# EAGLE design 7seg (EAGLE 7.2.0)
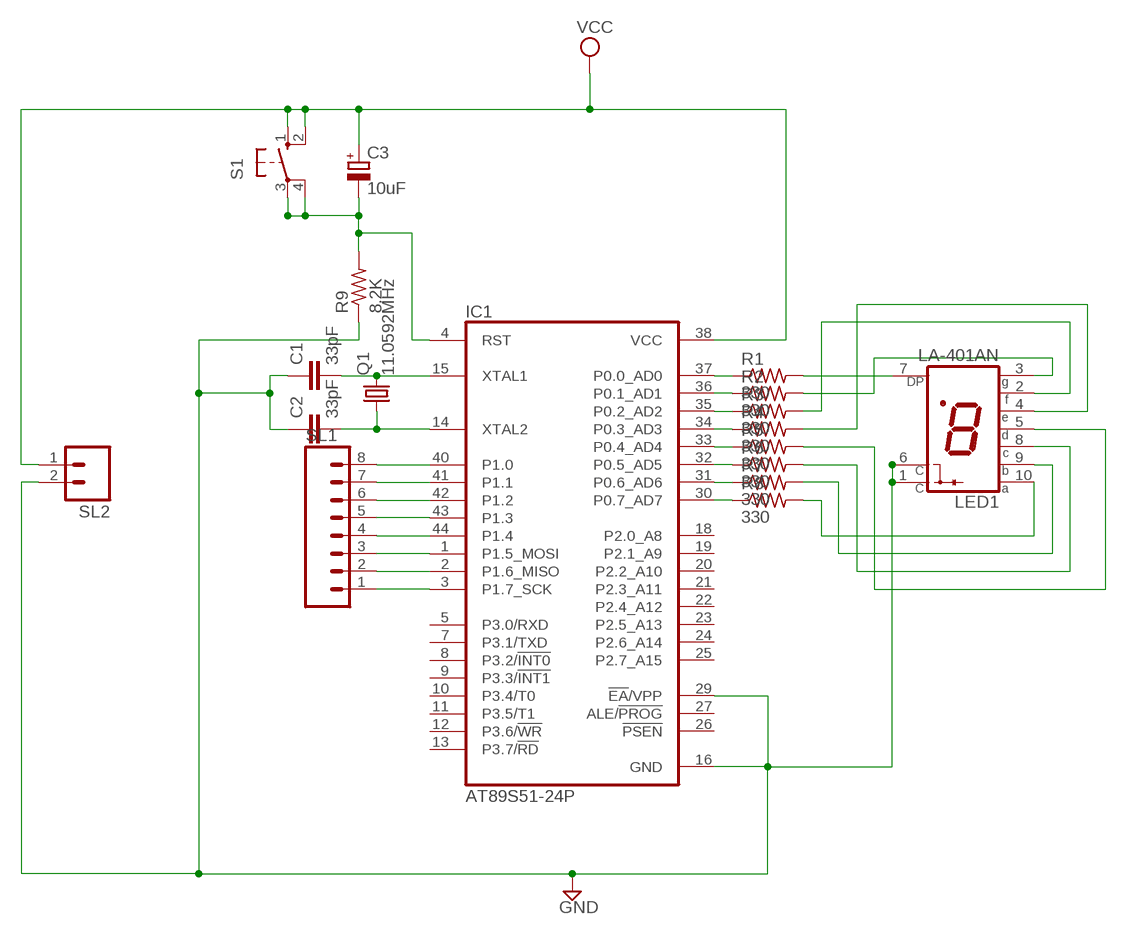
[diagram p0: schematic, sheet 1]

## Parts
C1  33pF  C-EUC1206K  [C1206K]
C2  33pF  C-EUC1206K  [C1206K]
C3  10uF  CPOL-EU140CLH-1010  [140CLH-1010]
IC1  AT89S51-24P  [TQFP44]
LED1  LA-401AN  [LA-401]
Q1  11.0592MHz  CRYSTALTC26V  [TC26V]
R1  330  R-US_M1206  [M1206]
R2  330  R-US_M1206  [M1206]
R3  330  R-US_M1206  [M1206]
R4  330  R-US_M1206  [M1206]
R5  330  R-US_M1206  [M1206]
R6  330  R-US_M1206  [M1206]
R7  330  R-US_M1206  [M1206]
R8  330  R-US_M1206  [M1206]
R9  8.2K  R-US_M1206  [M1206]
S1  10-XX  [B3F-10XX]
SL1  MA08  [08PA]
SL2  MA02  [02PA]

## Nets
GND: C1.1 C2.1 IC1.16(GND) IC1.29(!EA!/VPP) LED1.1(C) LED1.6(C) R9.1 SL2.2
N$1: IC1.37(P0.0_AD0) R1.1
N$2: IC1.36(P0.1_AD1) R2.1
N$3: IC1.35(P0.2_AD2) R3.1
N$4: IC1.34(P0.3_AD3) R4.1
N$5: IC1.33(P0.4_AD4) R5.1
N$6: IC1.32(P0.5_AD5) R6.1
N$7: IC1.31(P0.6_AD6) R7.1
N$8: IC1.30(P0.7_AD7) R8.1
N$9: LED1.7(DP) R1.2
N$10: LED1.3(G) R2.2
N$11: LED1.2(F) R3.2
N$13: LED1.10(A) R8.2
N$14: LED1.9(B) R7.2
N$15: LED1.8(C) R6.2
N$16: LED1.5(D) R5.2
N$17: LED1.4(E) R4.2
N$18: IC1.40(P1.0) SL1.8
N$19: IC1.41(P1.1) SL1.7
N$20: IC1.42(P1.2) SL1.6
N$21: IC1.43(P1.3) SL1.5
N$22: IC1.44(P1.4) SL1.4
N$23: IC1.1(P1.5_MOSI) SL1.3
N$24: IC1.2(P1.6_MISO) SL1.2
N$25: IC1.3(P1.7_SCK) SL1.1
N$26: C1.2 IC1.15(XTAL1) Q1.2
N$27: C2.2 IC1.14(XTAL2) Q1.1
N$30: C3.- IC1.4(RST) R9.2 S1.3(P) S1.4(P1)
VCC: C3.+ IC1.38(VCC) S1.1(S) S1.2(S1) SL2.1
Unconnected: IC1.5(P3.0/RXD) IC1.7(P3.1/TXD) IC1.8(P3.2/!INT0) IC1.9(P3.3/!INT1) IC1.10(P3.4/T0) IC1.11(P3.5/T1) IC1.12(P3.6/!WR) IC1.13(P3.7/!RD) IC1.18(P2.0_A8) IC1.19(P2.1_A9) IC1.20(P2.2_A10) IC1.21(P2.3_A11) IC1.22(P2.4_A12) IC1.23(P2.5_A13) IC1.24(P2.6_A14) IC1.25(P2.7_A15) IC1.26(!PSEN) IC1.27(ALE/!PROG)

## Power pins joined to a net without a drawn wire
GND: IC1.17(GND)

## Library data of the parts
C1 C2 = resistor:C-EU: CAPACITOR, European symbol
C3 = resistor:CPOL-EU: POLARIZED CAPACITOR, European symbol
IC1 = atmel:AT89S51*P: 8-bit Microcontroller with 4K BytesIn-System Programmable Flash Source: http://www.atmel.com/dyn/resources/prod_documents/doc2487.pdf; OC_FARNELL: unknown; OC_NEWARK: unknown
LED1 = led-7-segment:LA-401*N: Single Digit LED Numeric Display (cathode common) Source: ROHM .. la-1401dn.pdf; OC_FARNELL: unknown; OC_NEWARK: unknown
Q1 = crystal:CRYSTAL: CRYSTAL; OC_FARNELL: unknown; OC_NEWARK: unknown
R1-R9 = resistor:R-US_: RESISTOR, American symbol
S1 = switch-omron:10-XX: OMRON SWITCH; MPN: B3F-1000; OC_FARNELL: 176432; OC_NEWARK: 36M3542
SL1 = con-amp-quick:MA08: AMP QUICK CONNECTOR; OC_FARNELL: unknown; OC_NEWARK: unknown
SL2 = con-amp-quick:MA02: AMP QUICK CONNECTOR; OC_FARNELL: unknown; OC_NEWARK: unknown

## Board
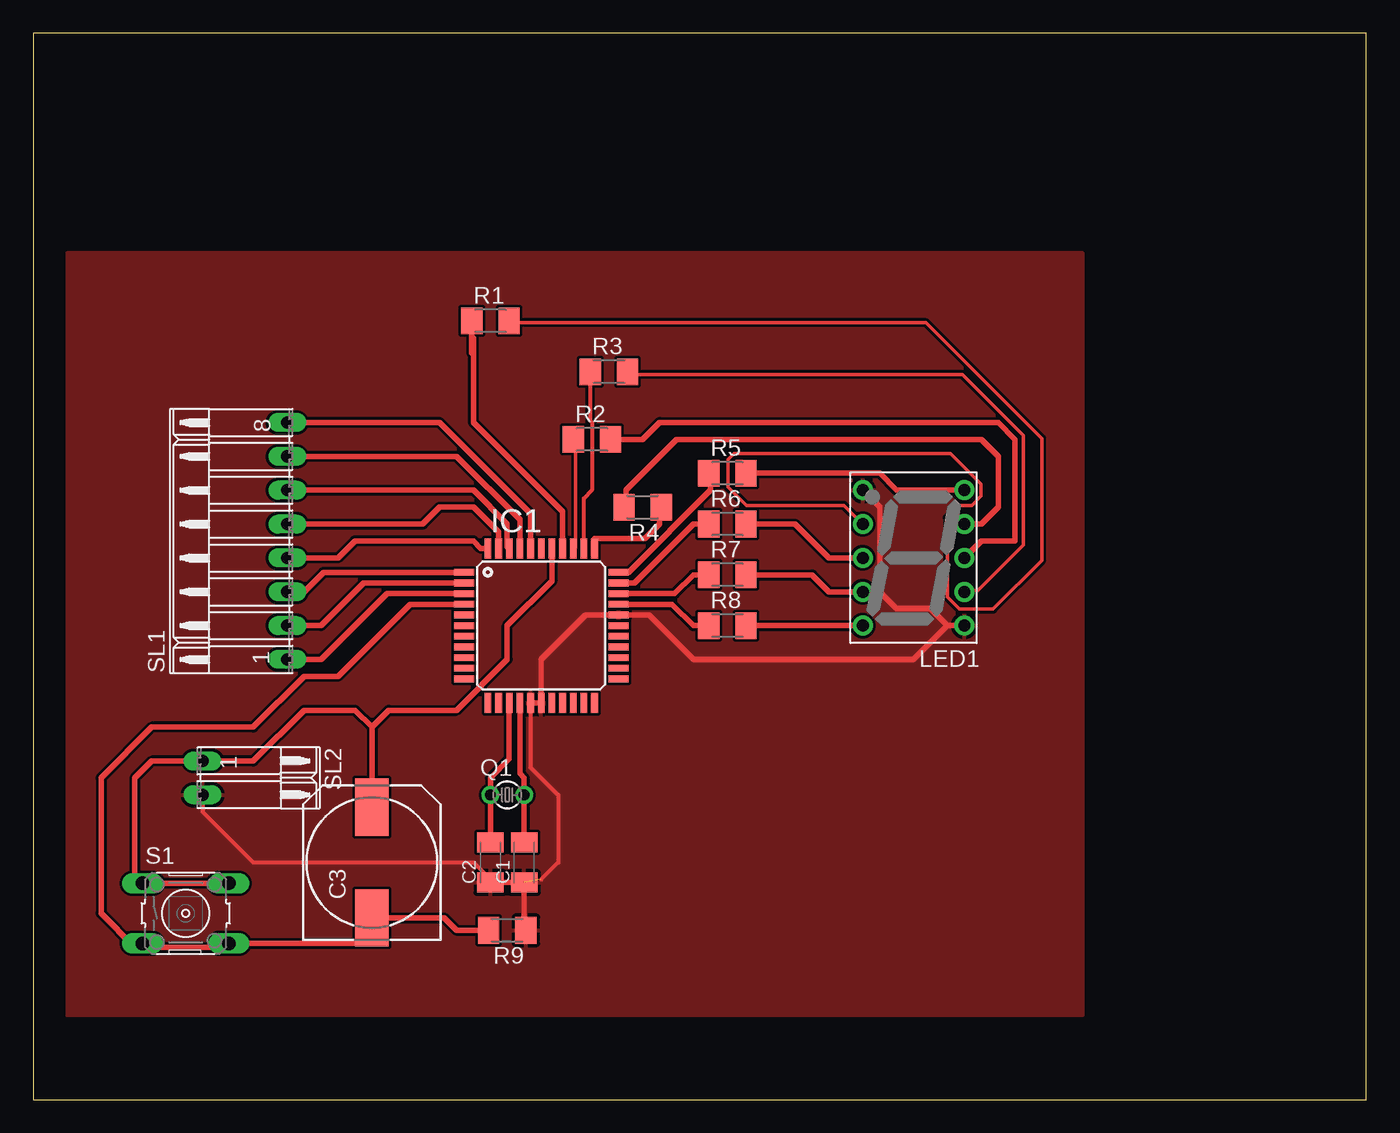
[diagram p1: board, top side]

Size 100 x 80 mm. Coordinates in mm from the lower left corner, seen from the top.
Outline: 0,0 100,0 100,80 0,80 0,0
Copper layers (1*16): Top 0.035mm / dielectric 1.5mm / Bottom 0.035mm
Design rules "default": minimum track width 10mil, minimum drill 24mil, track to track 8mil, track to pad 8mil, pad to pad 8mil, via to via 8mil, smd to smd 8mil, copper to edge 40mil, drill to drill 8mil, minimum pad ring 10mil, minimum via ring 8mil, stop-mask expansion 4mil, vias tented up to drill 0mil, thermal gap 10mil

### Footprints (pad centres in the part's own frame; a part is rotated, then mirrored left to right if it is on the bottom)
C1206K = smd 1.5 x 2: 1 -1.5,0; 2 1.5,0
140CLH-1010 = smd 4.3 x 2.5: + 4.15,0; - -4.15,0
TQFP44 = smd 1.5 x 0.5: 1 -5.8,4; 2 -5.8,3.2; 3 -5.8,2.4; 4 -5.8,1.6; 5 -5.8,0.8; 6 -5.8,0; 7 -5.8,-0.8; 8 -5.8,-1.6; 9 -5.8,-2.4; 10 -5.8,-3.2; 11 -5.8,-4; 23 5.8,-4; 24 5.8,-3.2; 25 5.8,-2.4; 26 5.8,-1.6; 27 5.8,-0.8; 28 5.8,0; 29 5.8,0.8; 30 5.8,1.6; 31 5.8,2.4; 32 5.8,3.2; 33 5.8,4 | smd 0.5 x 1.5: 12 -4,-5.8; 13 -3.2,-5.8; 14 -2.4,-5.8; 15 -1.6,-5.8; 16 -0.8,-5.8; 17 0,-5.8; 18 0.8,-5.8; 19 1.6,-5.8; 20 2.4,-5.8; 21 3.2,-5.8; 22 4,-5.8; 34 4,5.8; 35 3.2,5.8; 36 2.4,5.8; 37 1.6,5.8; 38 0.8,5.8; 39 0,5.8; 40 -0.8,5.8; 41 -1.6,5.8; 42 -2.4,5.8; 43 -3.2,5.8; 44 -4,5.8
LA-401 = drill 0.9 pad 1.5: 1 -3.81,5.08; 2 -3.81,2.54; 3 -3.81,0; 4 -3.81,-2.54; 5 -3.81,-5.08; 6 3.81,-5.08; 7 3.81,-2.54; 8 3.81,0; 9 3.81,2.54; 10 3.81,5.08
TC26V = drill 0.813: 1 -1.27,0; 2 1.27,0
M1206 = smd 1.6 x 2: 1 -1.4,0; 2 1.4,0
B3F-10XX = drill 1.016 long: 1 -3.251,2.261; 2 3.251,2.261; 3 -3.251,-2.261; 4 3.251,-2.261
08PA = drill 0.914 long: 1 -8.89,0; 2 -6.35,0; 3 -3.81,0; 4 -1.27,0; 5 1.27,0; 6 3.81,0; 7 6.35,0; 8 8.89,0
02PA = drill 0.914 long: 1 -1.27,0; 2 1.27,0

### Placement (x,y rotation side)
C1  36.83,17.78 90 top
C2  34.29,17.78 90 top
C3  25.4,17.78 90 top
IC1  38.1,35.56 0 top
LED1  66.04,40.64 180 top
Q1  35.56,22.86 0 top
R1  34.29,58.42 0 top
R2  41.91,49.53 0 top
R3  43.18,54.61 0 top
R4  45.72,44.45 180 top
R5  52.07,46.99 0 top
R6  52.07,43.18 0 top
R7  52.07,39.37 0 top
R8  52.07,35.56 0 top
R9  35.56,12.7 180 top
S1  11.43,13.97 0 top
SL1  19.05,41.91 90 top
SL2  12.7,24.13 270 top

### Tracks (layer width: path | path; a pad name or v marks a point on that pad's centre or on a via)
GND  (1 unrouted)
  Top 0.254: IC1.17 38.18,29.95 38.18,30.4 38.1,30.48
  Top 0.305: SL2.2 12.7,21.59 16.51,17.78 33.02,17.78 34.29,16.51 C2.1 | C1.1 36.83,16.51 | IC1.16 37.3,24.93 39.37,22.86 39.37,17.78 38.1,16.51
  Top 0.406: C2.1 C1.1 36.83,12.83 R9.1 | IC1.16 IC1.17 | 38.1,30.48 38.1,33.02 41.44,36.36 IC1.29 46.19,36.36 49.53,33.02 66.04,33.02 68.58,35.56 | 68.58,35.56 LED1.1 | 68.58,35.56 67.31,36.83 64.77,36.83 63.5,38.1 63.5,44.45 LED1.6
  pour Top: 2.54,63.5 2.54,6.35 78.74,6.35 78.74,63.5
N$1
  Top 0.406: IC1.37 39.7,44.12 33.02,50.8 33.02,55.88 | 33.02,55.88 33.02,57.15 | R1.1 32.89,56.01 33.02,55.88
N$2
  Top 0.254: IC1.36 40.69,41.38 40.69,49.38 R2.1
N$3
  Top 0.305: R3.1 41.78,50.93 41.91,50.8 41.91,45.72 41.3,45.11 IC1.35
N$4
  Top 0.406: IC1.34 42.1,42.1 45.91,42.1 46.99,43.18 46.99,44.32 R4.1
N$5
  Top 0.406: IC1.33 44.64,39.56 50.8,45.72 50.8,46.86 R5.1
N$6
  Top 0.406: IC1.32 45.11,38.76 49.53,43.18 R6.1
N$7
  Top 0.406: R7.1 49.53,39.37 48.12,37.96 IC1.31
N$8
  Top 0.406: IC1.30 47.93,37.16 49.53,35.56 R8.1
N$9
  Top 0.254: R1.2 35.89,58.29 66.98,58.29 75.67,49.61 75.67,40.46 72.01,36.8 69.49,36.8 68.58,37.72 68.58,43.66 69.49,44.58 70.41,44.58 71.09,45.26 71.09,46.18 68.81,48.46 52.58,48.46 52.12,48.01 52.12,45.95 53.49,44.58 60.81,44.58 62.18,43.2 LED1.7
N$10
  Top 0.406: R2.2 45.72,49.53 46.99,50.8 72.39,50.8 73.66,49.53 73.66,41.91 71.12,41.91 LED1.3
N$11
  Top 0.254: R3.2 44.81,54.41 69.72,54.41 74.3,49.84 74.3,41.6 70.87,38.18 69.95,38.18 LED1.2
N$13
  Top 0.406: R8.2 LED1.10
N$14
  Top 0.406: R7.2 58.42,39.37 59.69,38.1 LED1.9
N$15
  Top 0.406: LED1.8 59.69,40.64 57.15,43.18 R6.2
N$16
  Top 0.406: LED1.5 64.77,45.72 63.5,46.99 R5.2
N$17
  Top 0.406: LED1.4 71.12,43.18 72.39,44.45 72.39,48.26 71.12,49.53 48.26,49.53 44.45,45.72 44.45,44.58 R4.2
N$18
  Top 0.406: IC1.40 37.3,43.98 30.48,50.8 SL1.8
N$19
  Top 0.406: IC1.41 36.5,43.51 31.75,48.26 SL1.7
N$20
  Top 0.406: SL1.6 33.02,45.72 35.56,43.18 35.56,41.5 IC1.42
N$21
  Top 0.406: IC1.43 34.9,42.57 33.02,44.45 30.48,44.45 29.21,43.18 SL1.5
N$22
  Top 0.254: SL1.4 19.2,40.69 20.34,40.69 20.34,40.64
  Top 0.406: IC1.44 33.57,41.36 33.02,41.91 24.13,41.91 22.86,40.64 20.34,40.64 20.32,40.64
N$23
  Top 0.406: SL1.3 20.32,38.1 21.78,39.56 IC1.1
N$24
  Top 0.254: SL1.2 19.2,35.66 20.34,35.66 20.34,35.56
  Top 0.406: IC1.2 24.79,38.76 21.59,35.56 20.34,35.56 20.32,35.56
N$25
  Top 0.254: SL1.1 19.2,33.15 20.34,33.15 20.34,33.02
  Top 0.406: IC1.3 26.53,37.96 21.59,33.02 20.34,33.02 20.32,33.02
N$26
  Top 0.406: IC1.15 36.5,24.46 36.83,24.13 C1.2 Q1.2
N$27
  Top 0.406: IC1.14 35.7,25.54 34.29,24.13 C2.2 Q1.1
N$30
  Top 0.254: C3.- 25.38,13.72 25.4,13.72
  Top 0.406: C3.- 30.82,13.63 31.75,12.7 R9.2 | C3.- 25.4,12.7 24.41,11.71 S1.4 14.4,11.43 8.89,11.43 8.61,11.71 S1.3 7.9,11.43 7.62,11.43 5.08,13.97 5.08,24.13 8.89,27.94 16.51,27.94 20.32,31.75 22.86,31.75 28.27,37.16 IC1.4 | C3.- 25.4,13.72 25.4,13.97
VCC
  Top 0.254: C3.+ 25.38,21.95 25.38,22.86 25.4,22.86
  Top 0.406: 25.4,27.94 25.4,22.86 | IC1.38 38.9,38.9 35.56,35.56 35.56,33.02 31.75,29.21 26.67,29.21 25.4,27.94 | 25.4,27.94 24.13,29.21 20.32,29.21 16.51,25.4 SL2.1 8.89,25.4 7.62,24.13 7.62,16.79 S1.1 S1.2